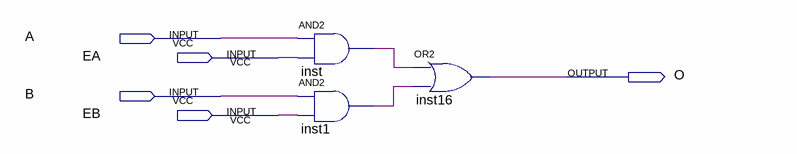
[diagram p0: schematic sheet]
// Quartus schematic SELECT2-2.bdf as structural Verilog: 3 symbols, 5 pins
module \SELECT2-2  (
  input  A,
  input  EA,
  input  B,
  input  EB,
  output O
);

  wire inst1_out, inst_out;

  and inst (inst_out, A, EA);
  and inst1 (inst1_out, B, EB);
  or inst16 (O, inst_out, inst1_out);
endmodule
